# Altium schematic sheet Pin Function Relays.SchDoc: Pin Function Relays
size A4; SheetNumber: 2; SheetTotal: 3
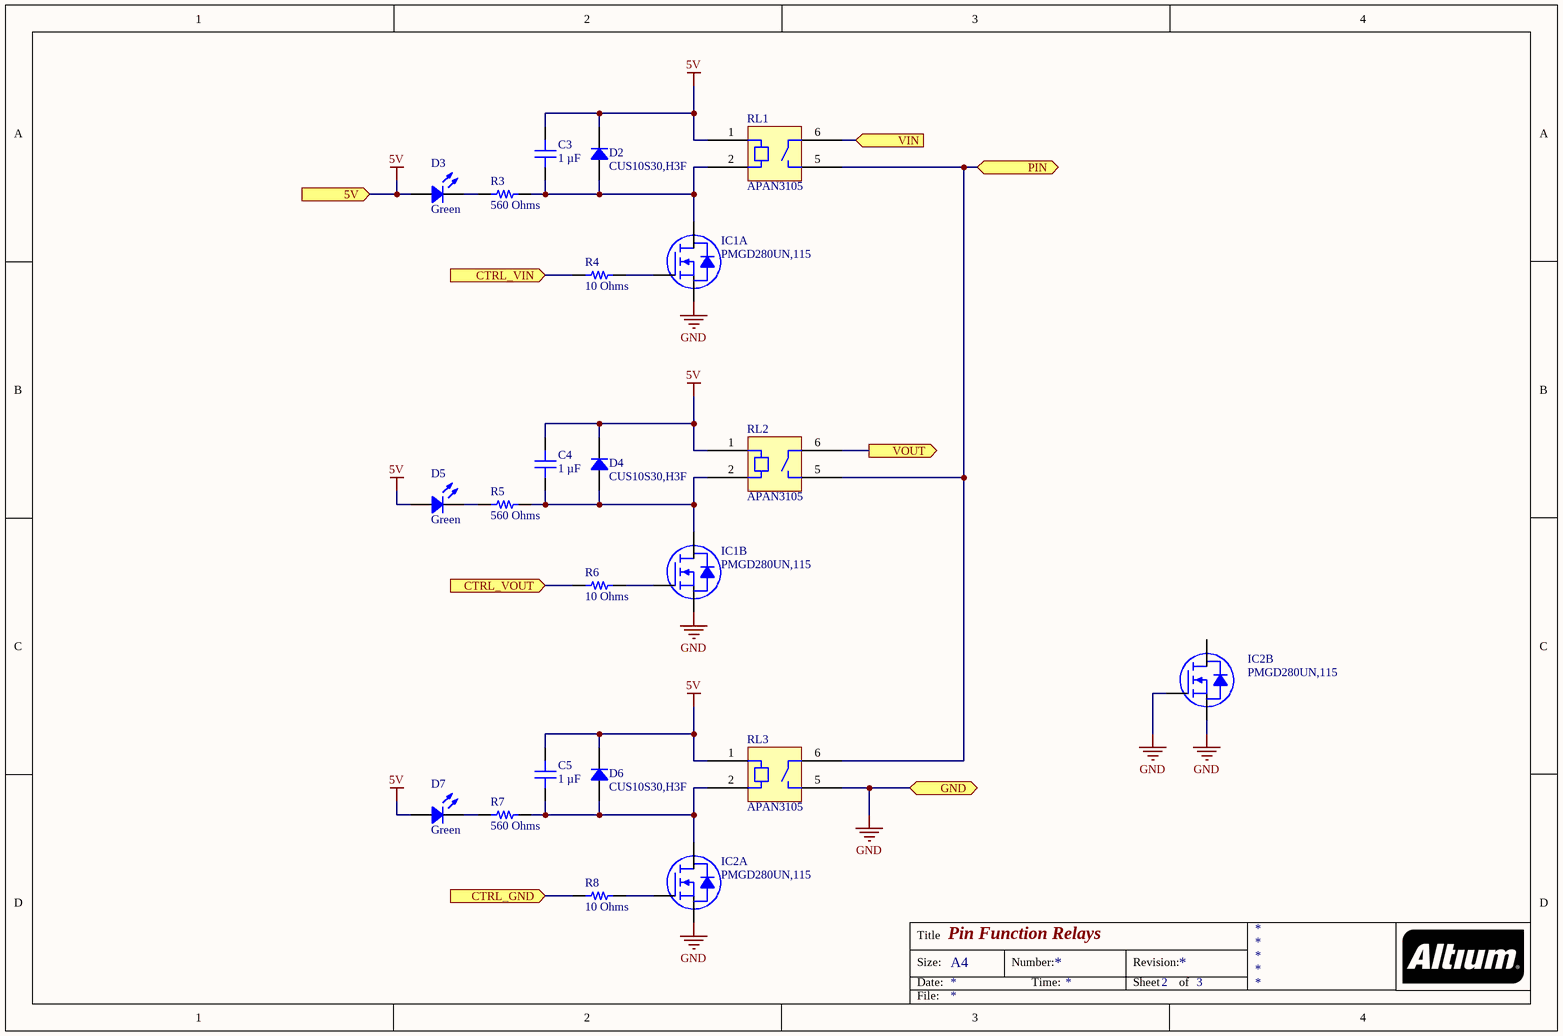
[diagram p0: Pin Function Relays.SchDoc]

## Parts
C3  1 µF  [CAP 0603_1608]
C4  1 µF  [CAP 0603_1608]
C5  1 µF  [CAP 0603_1608]
D2  CUS10S30,H3F  [SOD323]
D3  Green  [LED 0603_1608 GREEN]
D4  CUS10S30,H3F  [SOD323]
D5  Green  [LED 0603_1608 GREEN]
D6  CUS10S30,H3F  [SOD323]
D7  Green  [LED 0603_1608 GREEN]
IC1  PMGD280UN,115  [NXP SOT-363]  (parts A,B of 2)
IC2  PMGD280UN,115  [NXP SOT-363]  (parts A,B of 2)
R3  560 Ohms  [RES 0603_1608]
R4  10 Ohms  [RES 0603_1608]
R5  560 Ohms  [RES 0603_1608]
R6  10 Ohms  [RES 0603_1608]
R7  560 Ohms  [RES 0603_1608]
R8  10 Ohms  [RES 0603_1608]
RL1  APAN3105  [PANASONIC APAN31nn PA-N]
RL2  APAN3105  [PANASONIC APAN31nn PA-N]
RL3  APAN3105  [PANASONIC APAN31nn PA-N]

## Ports
5V (in, see DUT Pin[2C], Pin Decoupling[2A]), CTRL_GND (in, see DUT Pin[3C]), CTRL_VIN (in, see DUT Pin[3C]), CTRL_VOUT (in, see DUT Pin[3C]), GND (bidir, see DUT Pin[2C], Pin Decoupling[2B]), PIN (bidir, see DUT Pin[2C], Pin Decoupling[3A]), VIN (in, see DUT Pin[2C]), VOUT (out, see DUT Pin[3C])

## Nets
5V: C3.2 C4.2 C5.2 D2.2 D3.1 D4.2 D5.1 D6.2 D7.1 RL1.1(COIL1) RL2.1(COIL1) RL3.1(COIL1) ; port 5V
GND: IC1.1(S1) IC1.4(S2) IC2.1(S1) IC2.4(S2) IC2.5(G2) RL3.5(TERM1) ; port GND
CTRL_GND: R8.1 ; port CTRL_GND
CTRL_VIN: R4.1 ; port CTRL_VIN
CTRL_VOUT: R6.1 ; port CTRL_VOUT
PIN: RL1.5(TERM1) RL2.5(TERM1) RL3.6(TERM2) ; port PIN
VIN: RL1.6(TERM2) ; port VIN
VOUT: RL2.6(TERM2) ; port VOUT
NetC3_1: C3.1 D2.1 IC1.6(D1) R3.2 RL1.2(COIL2)
NetC4_1: C4.1 D4.1 IC1.3(D2) R5.2 RL2.2(COIL2)
NetC5_1: C5.1 D6.1 IC2.6(D1) R7.2 RL3.2(COIL2)
NetD3_2: D3.2 R3.1
NetD5_2: D5.2 R5.1
NetD7_2: D7.2 R7.1
NetIC1_2: IC1.2(G1) R4.2
NetIC1_5: IC1.5(G2) R6.2
NetIC2_2: IC2.2(G1) R8.2

Not connected (* = marked no-connect by the designer): IC2 3(D2)

## Notes on the sheet
- Title
- Size:
- Date:
- A4
- Number:
- Time:
- Revision:
- Sheet
- of
- File:

## Library data of the parts
C3-C5 = GCM188R71E105KA64D: CAP CER 1UF 25V X7R 0603; manufacturer: Murata Electronics; Tolerance: ±10%; Part Number: GCM188R71E105KA64D; Value: 1 µF; Applications: Automotive; Capacitance: 1 µF; componentlink1description: Datasheet; componentlink1url: https://www.murata.com/~/media/webrenewal/support/library/catalog/products/capacitor/mlcc/c03e.ashx?la=en-us; componentlink2description: DigiKey Link; componentlink2url: https://www.digikey.com/en/products/detail/murata-electronics/GCM188R71E105KA64D/4903956; Device Package: 0603 (1608 Metric); lastupdated: 20/08/2023 19:09:04; Lifecycle Status: Active; Minimum Order: 1; Mounting Type: Surface Mount, MLCC; Operating Temperature: -55°C ~ 125°C; Package / Case: 0603 (1608 Metric); packaging: TapeAndReel; partid: 6762; Part Status: Active; price: 0.03; Ratings: AEC-Q200; series: GCM; Size / Dimension: 0.063" L x 0.031" W (1.60mm x 0.80mm); Supplier 1: DigiKey; Supplier Part Number 1: 490-10673-1-ND; Temperature Coefficient: X7R; Thickness (Max): 0.035" (0.90mm); Voltage - Rated: 25V
D2 D4 D6 = CUS10S30,H3F: DIODE SCHOTTKY 30V 1A USC; Manufacturer: Toshiba Semiconductor and Storage; Capacitance @ Vr, F: 135pF @ 0V, 1MHz; Current - Reverse Leakage @ Vr: 500 µA @ 30 V; Speed: Fast Recovery =< 500ns, > 200mA (Io); Voltage - Forward (Vf) (Max) @ If: 230 mV @ 100 mA; Part Number: CUS10S30,H3F; ComponentLink1Description: Datasheet; ComponentLink1URL: https://toshiba.semicon-storage.com/info/docget.jsp?did=14077&prodName=CUS10S30; ComponentLink2Description: DigiKey Link; ComponentLink2URL: https://www.digikey.com/en/products/detail/toshiba-semiconductor-and-storage/CUS10S30-H3F/5114299; Current - Average Rectified (Io): 1A; Diode Type: Schottky; LastUpdated: 20/08/2023 20:43:26; Lifecycle Status: Active; Minimum Order: 1; Mounting Type: Surface Mount; Operating Temperature - Junction: 125°C (Max); Package / Case: SC-76, SOD-323; Packaging: TapeAndReel; PartId: 3067; Part Status: Active; Price: 0.05; Series: -; Supplier 1: DigiKey; Supplier Part Number 1: CUS10S30H3FCT-ND; Supplier Device Package: USC; Voltage - DC Reverse (Vr) (Max): 30 V
D3 D5 D7 = SML-LX0603GW-TR: LED GREEN DIFFUSED SMD; Manufacturer: Lumex Opto/Components Inc.; Configuration: Standard; Current - Test: 20mA; Lens Color: White; Lens Size: 1.00mm x 0.80mm; Lens Style: Rectangle with Flat Top; Millicandela Rating: 18mcd; Viewing Angle: 160°; Voltage - Forward (Vf) (Typ): 2.2V; Wavelength - Peak: 565nm; Part Number: SML-LX0603GW-TR; Color: Green; ComponentLink1Description: Datasheet; ComponentLink1URL: https://www.lumex.com/content/files/ProductAttachment/SML-LX0603GW-TR.pdf; ComponentLink2Description: DigiKey Link; ComponentLink2URL: https://www.digikey.com/en/products/detail/lumex-opto-components-inc/SML-LX0603GW-TR/304359; Device Package: 0603 (1608 Metric); Height (Max): 0.60mm; LastUpdated: 20/08/2023 20:23:28; Lens Transparency: Diffused; Lifecycle Status: Active; Minimum Order: 1; Mounting Type: Surface Mount; Package / Case: 0603 (1608 Metric); Packaging: TapeAndReel; PartId: 665; Part Status: Active; Price: 0.05; Series: -; Size / Dimension: 1.60mm L x 0.80mm W; Supplier 1: DigiKey; Supplier Part Number 1: 67-1549-1-ND; Value: Green
IC1 IC2 = PMGD280UN,115: MOSFET 2N-CH 20V 0.87A 6TSSOP; Manufacturer: Nexperia USA Inc.; Current - Continuous Drain (Id) @ 25°C: 870mA; FET Feature: Logic Level Gate; FET Type: 2 N-Channel (Dual); Gate Charge (Qg) (Max) @ Vgs: 0.89nC @ 4.5V; Input Capacitance (Ciss) (Max) @ Vds: 45pF @ 20V; Power - Max: 400mW; Rds On (Max) @ Id, Vgs: 340mOhm @ 200mA, 4.5V; Vgs(th) (Max) @ Id: 1V @ 250µA; Part Number: PMGD280UN,115; ComponentLink1Description: Datasheet; ComponentLink1URL: https://assets.nexperia.com/documents/data-sheet/PMGD280UN.pdf; ComponentLink2Description: DigiKey Link; ComponentLink2URL: http://digikey.com/product-detail/en/nexperia-usa-inc/PMGD280UN115/1727-3125-1-ND/949700; Drain to Source Voltage (Vdss): 20V; LastUpdated: 20/08/2023 20:47:11; Lifecycle Status: Active; Minimum Order: 1; Mounting Type: Surface Mount; Operating Temperature: -55°C ~ 150°C (TJ); Package / Case: 6-TSSOP, SC-88, SOT-363; Packaging: TapeAndReel; Part Status: Active; Price: 0.09; Series: TrenchMOS™; Supplier 1: DigiKey; Supplier Part Number 1: 1727-3125-1-ND; Supplier Device Package: 6-TSSOP
R3 R5 R7 = RC0603FR-07560RL: RES 560 OHM 1% 1/10W 0603; Manufacturer: Yageo; Power (Watts): 0.1W, 1/10W; Temperature Coefficient: ±100ppm/°C; Part Number: RC0603FR-07560RL; Value: 560 Ohms; ComponentLink1Description: Datasheet; ComponentLink1URL: https://www.yageo.com/upload/media/product/productsearch/datasheet/rchip/PYu-RC_Group_51_RoHS_L_10.pdf; ComponentLink2Description: DigiKey Link; ComponentLink2URL: https://www.digikey.com/en/products/detail/yageo/RC0603FR-07560RL/727304; Composition: Thick Film; Device Package: 0603 (1608 Metric); Features: Moisture Resistant; Height - Seated (Max): 0.022" (0.55mm); LastUpdated: 20/08/2023 19:34:59; Lifecycle Status: Active; Minimum Order: 1; Number of Terminations: 2; Operating Temperature: -55°C ~ 155°C; Package / Case: 0603 (1608 Metric); Packaging: CutTape; PartId: 18972; Part Status: Active; Price: 0.01; Resistance: 560 Ohms; Series: RC_L; Size / Dimension: 0.063" L x 0.031" W (1.60mm x 0.80mm); Supplier 1: DigiKey; Supplier Part Number 1: 311-560HRCT-ND; Supplier Device Package: 0603; Tolerance: ±1%
R4 R6 R8 = RC0603FR-0710RL: RES 10 OHM 1% 1/10W 0603; Manufacturer: Yageo; Power (Watts): 0.1W, 1/10W; Temperature Coefficient: ±200ppm/°C; Part Number: RC0603FR-0710RL; Value: 10 Ohms; ComponentLink1Description: Datasheet; ComponentLink1URL: https://www.yageo.com/upload/media/product/productsearch/datasheet/rchip/PYu-RC_Group_51_RoHS_L_10.pdf; ComponentLink2Description: DigiKey Link; ComponentLink2URL: https://www.digikey.com/en/products/detail/yageo/RC0603FR-0710RL/726879; Composition: Thick Film; Device Package: 0603 (1608 Metric); Features: Moisture Resistant; Height - Seated (Max): 0.022" (0.55mm); LastUpdated: 20/08/2023 19:34:43; Lifecycle Status: Active; Minimum Order: 1; Number of Terminations: 2; Operating Temperature: -55°C ~ 155°C; Package / Case: 0603 (1608 Metric); Packaging: TapeAndReel; PartId: 22607; Part Status: Active; Price: 0.01; Resistance: 10 Ohms; Series: RC_L; Size / Dimension: 0.063" L x 0.031" W (1.60mm x 0.80mm); Supplier 1: DigiKey; Supplier Part Number 1: 311-10.0HRCT-ND; Supplier Device Package: 0603; Tolerance: ±1%
RL1-RL3 = APAN3105: RELAY GENERAL PURPOSE SPST 5A 5V; Manufacturer: Panasonic Electric Works; Coil Current: 22mA; Coil Type: Non Latching; Coil Voltage: 5VDC; Contact Form: SPST-NO (1 Form A); Must Operate Voltage: 3.5 VDC; Must Release Voltage: 0.25 VDC; Operate Time: 10ms; Release Time: 5ms; Seal Rating: Sealed - Fully; Switching Voltage: 250VAC, 110VDC - Max; Part Number: APAN3105; ComponentLink1Description: Datasheet; ComponentLink1URL: //media.digikey.com/pdf/Data%20Sheets/Panasonic%20Electric%20Works%20PDFs/PA-N_Series.pdf; ComponentLink2Description: DigiKey Link; ComponentLink2URL: http://digikey.com/product-detail/en/panasonic-electric-works/APAN3105/255-5324-5-ND/6009007; Contact Material: Silver Nickel (AgNi), Gold (Au); Contact Rating (Current): 5A; LastUpdated: 16/08/2023 16:44:09; Lifecycle Status: Active; Minimum Order: 1; Mounting Type: Through Hole; Operating Temperature: -40°C ~ 90°C; Packaging: Tube; Part Status: Active; Price: 5.50; Relay Type: General Purpose; Series: PA-N; Supplier 1: DigiKey; Supplier Part Number 1: 255-5324-5-ND; Termination Style: PC Pin